# Altium schematic sheet Communications.SchDoc
size A3
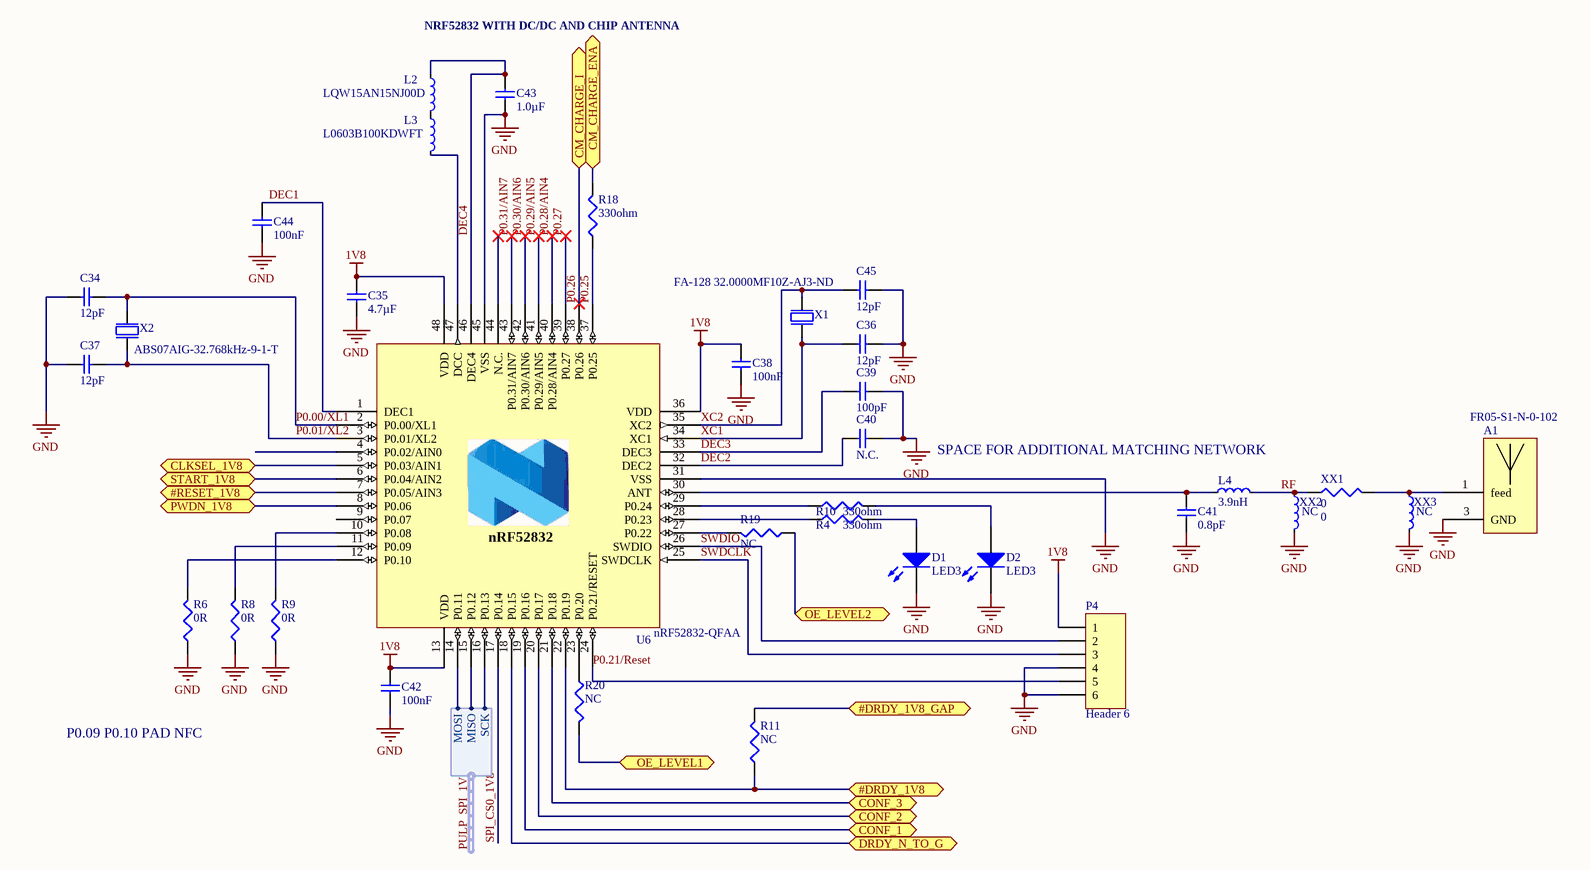
[diagram p0: Communications.SchDoc]

## Parts
A1  FR05-S1-N-0-102  [ANTENNACHIP]
C34  12pF  [CAPC1005X04L]
C35  4.7µF  [CAPC1608X06L]
C36  12pF  [CAPC1005X04L]
C37  12pF  [CAPC1005X04L]
C38  100nF  [CAPC1005X04L]
C39  100pF  [CAPC1005X04L]
C40  N.C.  [CAPC1005X04L]
C41  0.8pF  [CAPC1005X04L]
C42  100nF  [CAPC1005X04L]
C43  1.0µF  [CAPC1608X06L]
C44  100nF  [CAPC1005X04L]
C45  12pF  [CAPC1005X04L]
D1  LED3  [0603]
D2  LED3  [0603]
L2  LQW15AN15NJ00D  [INDC1005X04L]
L3  L0603B100KDWFT  [J1-0603]
L4  3.9nH  [INDC1005X04L]
P4  Header 6  [mini_6POLES_SWD]
R4  value 330ohm  [res_0402_R - modified]  (hidden comment: Res3)
R6  0R  [0402]
R8  0R  [0402]
R9  0R  [0402]
R10  value 330ohm  [res_0402_R - modified]  (hidden comment: Res3)
R11  NC  [0402]
R18  value 330ohm  [res_0402_R - modified]  (hidden comment: Res3)
R19  NC  [0402]
R20  NC  [0402]
U6  nRF52832-QFAA  [QFN40P600X600X90-48N]
X1  FA-128 32.0000MF10Z-AJ3-ND  [BT-XTAL_2016]
X2  ABS07AIG-32.768kHz-9-1-T  [XTAL_3215]
XX1  0  [0402]
XX2  NC  [INDC1005X04L]
XX3  NC  [INDC1005X04L]

## Ports
#DRDY_1V8, #DRDY_1V8_GAP, #RESET_1V8, CLKSEL_1V8, CM_CHARGE_ENA (bidir), CM_CHARGE_I (bidir), CONF_1, CONF_2, CONF_3, DRDY_N_TO_G, OE_LEVEL1, OE_LEVEL2, PWDN_1V8, START_1V8

## Harnesses
SPI: SCK, MISO, MOSI

## Nets
1V8: C35.1 C38.1 C42.1 P4.1 U6.13(VDD) U6.36(VDD) U6.48(VDD)
GND: A1.3(GND) C34.2 C35.2 C36.2 C37.2 C38.2 C39.2 C40.1 C41.1 C42.2 C43.1 C44.2 C45.2 D1.2(K) D2.2(K) P4.4 P4.6 R6.2 R8.2 R9.2 U6.31(VSS) U6.45(VSS) U6.49(GND) X1.2(GND) X1.4(GND) XX2.2 XX3.2
#DRDY_1V8: R11.2 U6.22(P0.19) ; port #DRDY_1V8
#DRDY_1V8_GAP: R11.1 ; port #DRDY_1V8_GAP
#RESET_1V8: U6.7(P0.05/AIN3) ; port #RESET_1V8
CLKSEL_1V8: U6.5(P0.03/AIN1) ; port CLKSEL_1V8
CM_CHARGE_ENA: R18.2 ; port CM_CHARGE_ENA
CONF_1: U6.19(P0.16) ; port CONF_1
CONF_2: U6.20(P0.17) ; port CONF_2
CONF_3: U6.21(P0.18) ; port CONF_3
DEC1: C44.1 U6.1(DEC1)
DEC2: C40.2 U6.32(DEC2)
DEC3: C39.1 U6.33(DEC3)
DEC4: C43.2 L2.1 U6.46(DEC4)
DRDY_N_TO_G: U6.18(P0.15) ; port DRDY_N_TO_G
OE_LEVEL1: R20.1 ; port OE_LEVEL1
OE_LEVEL2: R19.2 ; port OE_LEVEL2
P0.00/XL1: C34.1 U6.2(P0.00/XL1) X2.1(inp)
P0.01/XL2: C37.1 U6.3(P0.01/XL2) X2.2(out)
P0.21/Reset: P4.5 U6.24(P0.21/RESET)
P0.25: R18.1 U6.37(P0.25)
P0.26: U6.38(P0.26) ; port CM_CHARGE_I
P0.27: U6.39(P0.27)
P0.28/AIN4: U6.40(P0.28/AIN4)
P0.29/AIN5: U6.41(P0.29/AIN5)
P0.30/AIN6: U6.42(P0.30/AIN6)
P0.31/AIN7: U6.43(P0.31/AIN7)
PULP_SPI_1V8.MISO: U6.15(P0.12) ; harness SPI.MISO
PULP_SPI_1V8.MOSI: U6.14(P0.11) ; harness SPI.MOSI
PULP_SPI_1V8.SCK: U6.16(P0.13) ; harness SPI.SCK
PWDN_1V8: U6.8(P0.06) ; port PWDN_1V8
RF: L4.2 XX1.1 XX2.1
SPI_CS0_1V8: U6.17(P0.14)
START_1V8: U6.6(P0.04/AIN2) ; port START_1V8
SWDCLK: P4.3 U6.25(SWDCLK)
SWDIO: P4.2 U6.26(SWDIO)
XC1: C36.1 U6.34(XC1) X1.1(inp)
XC2: C45.1 U6.35(XC2) X1.3(out)
NetA1_1: A1.1(feed) XX1.2 XX3.1
NetC41_2: C41.2 L4.1 U6.30(ANT)
NetD1_1: D1.1(A) R4.2
NetD2_1: D2.1(A) R10.2
NetL2_2: L2.2 L3.1
NetL3_2: L3.2 U6.47(DCC)
NetR4_1: R4.1 U6.28(P0.23)
NetR6_1: R6.1 U6.12(P0.10)
NetR8_1: R8.1 U6.11(P0.09)
NetR9_1: R9.1 U6.10(P0.08)
NetR10_1: R10.1 U6.29(P0.24)
NetR19_1: R19.1 U6.27(P0.22)
NetR20_2: R20.2 U6.23(P0.20)

Not connected (* = marked no-connect by the designer): A1 2(not_connected); U6 4(P0.02/AIN0) 9(P0.07) 44(N.C.)*

## Notes on the sheet
- NRF52832 WITH DC/DC AND CHIP ANTENNA
- SPACE FOR ADDITIONAL MATCHING NETWORK
- P0.09 P0.10 PAD NFC
- (in symbol nRF52832-QFAB) nRF52832

## Library data of the parts
A1 = FR05-S1-N-0-102: Bluetooth antenna
C34 C36 C37 C45 = C0402-12p: Capacitor, NP0, ±2%; Note: 50V; Artikkelnr Noca: 20029159; Artikkelnr Simpro: N.A.; Part Number: C0402-12p; Manufacturer: *; Manufacturer Part Number: *; Datasheet: *; LatestRevisionDate: 2011-05-11; Pin Count: 2; Publisher: Nordic Semiconductor; Published: 2009-05-08; Value: 12pF; Supplier: *; Supplier part number: *; 2nd source Supplier: *; 2nd source part number: *; Footprint Doc: 0402
C35 = C0603-4µ7: Capacitor, X5R, ±10%; Note: 6.3V; Artikkelnr Noca: 20069060; Artikkelnr Simpro: N.A.; Part Number: C0603-4µ7; Manufacturer: *; Manufacturer Part Number: *; Datasheet: *; LatestRevisionDate: 2009-11-23; Pin Count: 2; Publisher: Nordic Semiconductor; Published: 2009-05-08; Value: 4.7µF; Supplier: *; Supplier part number: *; 2nd source Supplier: *; 2nd source part number: *; Footprint Doc: 0603
C38 C42 C44 = C0402-100n: Capacitor, X7R, ±10%; Note: 16V; Artikkelnr Noca: 20039200; Artikkelnr Simpro: N.A.; Part Number: C0402-100n; Manufacturer: *; Manufacturer Part Number: *; Datasheet: *; LatestRevisionDate: 2009-11-23; Pin Count: 2; Publisher: Nordic Semiconductor; Published: 2009-05-08; Value: 100nF; Supplier: *; Supplier part number: *; 2nd source Supplier: *; 2nd source part number: *; Footprint Doc: 0402
C39 = C0402-100p: Capacitor, NP0, ±5%; Note: 50V; Artikkelnr Noca: 20029135; Artikkelnr Simpro: N.A.; Part Number: C0402-100p; Manufacturer: *; Manufacturer Part Number: *; Datasheet: *; LatestRevisionDate: 2009-05-08; Pin Count: 2; Publisher: Nordic Semiconductor; Published: 2009-05-08; Value: 100pF; Supplier: *; Supplier part number: *; 2nd source Supplier: *; 2nd source part number: *; Footprint Doc: 0402
C40 = C0402-N.C.: Not mounted; Note: Chip Cap; Artikkelnr Noca: N.A.; Part Number: C0402-N.C.; Manufacturer: *; Manufacturer Part Number: *; Datasheet: *; LatestRevisionDate: 2009-05-08; Pin Count: 2; Publisher: Nordic Semiconductor; Published: 2009-05-08; Value: N.C.; Supplier: *; Supplier part number: *; 2nd source Supplier: *; 2nd source part number: *; Footprint Doc: 0402; Artikkelnr Simpro: N.A.
C41 = C0402-0.8p: Capacitor, NP0, ±5%; Note: 50V; Artikkelnr Noca: 20029147; Artikkelnr Simpro: N.A.; Part Number: C0402-0.8p; Manufacturer: *; Manufacturer Part Number: *; Datasheet: *; LatestRevisionDate: 2012-11-21; Pin Count: 2; Publisher: Nordic Semiconductor; Published: 2009-05-08; Value: 0.8pF; Supplier: *; Supplier part number: *; 2nd source Supplier: *; 2nd source part number: *; Footprint Doc: 0402
C43 = C0603-1µ0: Capacitor, X7R, ±10%; Note: 16V; Artikkelnr Noca: 20039335; Artikkelnr Simpro: N.A.; Part Number: C0603-1µ0; Manufacturer: *; Manufacturer Part Number: *; Datasheet: *; LatestRevisionDate: 2013-06-05; Pin Count: 2; Publisher: Nordic Semiconductor; Published: 2009-05-08; Value: 1.0µF; Supplier: *; Supplier part number: *; 2nd source Supplier: *; 2nd source part number: *; Footprint Doc: 0603
D1 D2 = LED3: Typical BLUE SiC LED; Published: 8-Jun-2000; LatestRevisionDate: 17-Dec-2003; LatestRevisionNote: PCB Footprint replaced.; DatasheetVersion: 16-Apr-2002; PackageVersion: 16-Apr-2002; PackageReference: 3.5X2.8X1.9; Publisher: Altium Limited; PackageDescription: SM LED; 2 C-Bend Leads; Body 3.5 x 2.8 x 1.9 mm, inc leads (LxWxH typ)
L2 = L0402-15n: High frequency chip inductor ±10%; Manufacturer: Taiyo Yuden; Manufacturer Part Number: HK100515NJ-T; 2nd source part number: 658-1328; Value: 15nH; Artikkelnr Noca: 33029323; Artikkelnr Simpro: N.A.; Part Number: L0402-15n; LatestRevisionDate: 2012-09-19; Pin Count: 2; Publisher: Nordic Semiconductor; Published: 2010-07-12; Note: High frequency chip inductor ±10%; Supplier: Digi-Key; Datasheet: http://www.yuden.co.jp/productdata/catalog/en/mlci04_e.pdf; Supplier part number: 587-1521-1-ND; 2nd source Supplier: Farnell; Footprint Doc: 0402
L3 = L0603-10µ: Chip inductor, IDC,min = 50 mA, ±20%; Manufacturer: Taiyo Yuden; Manufacturer Part Number: LBMF1608T100K; 2nd source part number: 178-6105; Value: 10µH; Note: LBMF1608T100K 10µH 80mA 0603; Artikkelnr Noca: 33029314; Artikkelnr Simpro: N.A.; Part Number: L0603-10µ; Datasheet: http://www.yuden.co.jp/ut/product/pdf/elb2_e.pdf; LatestRevisionDate: 2012-09-19; Pin Count: 2; Publisher: Nordic Semiconductor; Published: 2010-02-24; Supplier: Digi-Key; Supplier part number: 587-1714-1-ND; 2nd source Supplier: Farnell; Footprint Doc: 0603
L4 = L0402-3n9: High frequency chip inductor ±5%; Manufacturer: Murata; Manufacturer Part Number: LQP15MN3N9B02D; Artikkelnr Noca: 33029151; Artikkelnr Simpro: N.A.; Part Number: L0402-3n9; Datasheet: http://search.murata.co.jp/Ceramy/image/img/PDF/ENG/L0075S0084LQP15M.pdf; LatestRevisionDate: 2012-09-19; Pin Count: 2; Publisher: Nordic Semiconductor; Published: 2009-05-08; Value: 3.9nH; Note: High frequency chip inductor ±5%; Supplier: Digi-Key; Supplier part number: 490-1131-1-ND; 2nd source Supplier: *; 2nd source part number: *; Footprint Doc: 0402
P4 = Header 6: Header, 6-Pin; LatestRevisionDate: 17-Jul-2002; LatestRevisionNote: Re-released for DXP Platform.; Publisher: Altium Limited
R4 R6 R8-R11 R18-R20 XX1 = Res3: Resistor; Published: 8-Jun-2000; LatestRevisionDate: 29-May-2009; LatestRevisionNote: IPC-7351 Footprint Added.; PackageReference: J1-0603; Publisher: Altium Limited; PackageDescription: Chip Resistor
  R6 R8 R9: Value: 0R
  R11 R19 R20: Value: NC
  XX1: Value: 0
U6 = nRF52832-QFAB: Multi-protocol Bluetooth Low Energy, ANT and 2.4GHz proprietary system-on-chip; Manufacturer: Nordic Semiconductor; Artikkelnr Noca: N.A.; Part Number: nRF52832-QFAA; Manufacturer Part Number: nRF52832-QFAA; Datasheet: *; LatestRevisionDate: 2016-11-24; Pin Count: 48; Publisher: Nordic Semiconductor; Published: 2016-11-24; Value: nRF52832-QFAA; Note: *; Supplier: Nordic Semiconductor; Supplier part number: *; 2nd source Supplier: *; 2nd source part number: *; Footprint Doc: QFN-48; Artikkelnr Simpro: N.A.
X1 = XTAL_SMD2016_32MHz_8pF_General: XTAL SMD 2016, 32MHz, Cl=8pF, Total Tol: ±40ppm; Note: XTAL SMD 32.000MHz; Artikkelnr Noca: N.A.; Part Number: XTAL_SMD2016_32MHz_8pF_General; Manufacturer: *; Manufacturer Part Number: *; Datasheet: *; LatestRevisionDate: 2016-08-19; Pin Count: 4; Publisher: Nordic Semiconductor; Published: 2016-08-19; Value: 32MHz; Supplier: *; Supplier part number: *; 2nd source Supplier: *; 2nd source part number: *; Footprint Doc: XTAL_2016; Artikkelnr Simpro: N.A.
X2 = XTAL_SMD3215_32.768kHz_9pF_General: XTAL SMD 3215, 32.768kHz, Cl=9pF, Total Tol: ±50ppm; Note: XTAL SMD 32.768kHz; Artikkelnr Noca: N.A.; Part Number: XTAL_SMD3215_32.768kHz_9pF_General; Manufacturer: *; Manufacturer Part Number: *; Datasheet: *; LatestRevisionDate: 2016-08-19; Pin Count: 2; Publisher: Nordic Semiconductor; Published: 2016-08-19; Value: 32.768kHz; Supplier: *; Supplier part number: *; 2nd source Supplier: *; 2nd source part number: *; Footprint Doc: XTAL_3215; Artikkelnr Simpro: N.A.
XX2 XX3 = L0402-N.C.: Not mounted; Value: N.C.; Artikkelnr Noca: N.A.; Assembly: Not mounted; Part Number: L0402-N.C.; Manufacturer: *; Manufacturer Part Number: *; Datasheet: *; LatestRevisionDate: 2016-11-24; Pin Count: 2; Publisher: Nordic Semiconductor; Published: 2016-11-24; Note: *; Supplier: *; Supplier part number: *; 2nd source Supplier: *; 2nd source part number: *; Footprint Doc: 0402; Artikkelnr Simpro: N.A.; ComponentLink1Description: Datasheet; ComponentLink2Description: Supplier link